# Altium schematic sheet Debug.SchDoc
size A
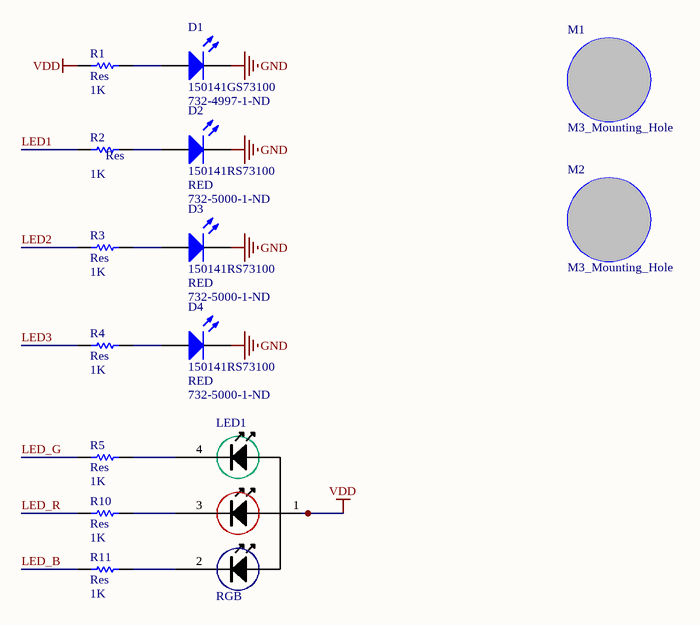
[diagram p0: Debug.SchDoc]

## Parts
D1  150141GS73100  Supplier Part Number 1: 732-4997-1-ND  [150141RS73100]
D2  150141RS73100  Colour: RED  Supplier Part Number 2: 732-5000-1-ND  [150141RS73100]
D3  150141RS73100  Colour: RED  Supplier Part Number 2: 732-5000-1-ND  [150141RS73100]
D4  150141RS73100  Colour: RED  Supplier Part Number 2: 732-5000-1-ND  [150141RS73100]
LED1  RGB  [1411LED]
M1  M3_Mounting_Hole  [M3_Mounting_Hole]
M2  M3_Mounting_Hole  [M3_Mounting_Hole]
R1  Res  value 1K  [3216[1206]]
R2  Res  value 1K  [3216[1206]]
R3  Res  value 1K  [3216[1206]]
R4  Res  value 1K  [3216[1206]]
R5  Res  value 1K  [3216[1206]]
R10  Res  value 1K  [3216[1206]]
R11  Res  value 1K  [3216[1206]]

## Nets
GND: D1.2(K) D2.2(K) D3.2(K) D4.2(K)
VDD: LED1.1 R1.1
LED1: R2.1
LED2: R3.1
LED3: R4.1
LED_B: R11.1
LED_G: R5.1
LED_R: R10.1
NetD1_1: D1.1(A) R1.2
NetD2_1: D2.1(A) R2.2
NetD3_1: D3.1(A) R3.2
NetD4_1: D4.1(A) R4.2
NetLED1_2: LED1.2 R11.2
NetLED1_3: LED1.3 R10.2
NetLED1_4: LED1.4 R5.2

## Library data of the parts
D1 = 150141GS73100: Typical GREEN LED; Manufacturer: Würth Elektronik (Wuerth Elektronik); Luminous Intensity: 1000; Viewing Angle: 120; Forward Voltage: 3.1; Lens Style: Round,Clear; Wavelength: 525; Forward Current: 30; Test Current: 20; Supplier 1: Digikey; Manufacturer Part Number: 150141GS73100; Stock 1: 572; Pricing 1: 1=0.17, 100=0.149, 500=0.113 (USD); Case/Package: 1411; Colour: Green; Case Code (Metric): 3528; Case Code (Imperial): 1411; Min Operating Temperature: -40; Max Operating Temperature: 85; Packaging: Cut Tape; Package Quantity: 2000; Dominant Wavelength: 525; Length: 3.5; Height: 1.9; Width: 2.8; REACH SVHC: Unknown; Lead Free: Lead Free; ComponentLink1URL: https://datasheet.ciiva.com/23843/150141gs73100-23843266.pdf; ComponentLink1Description: https://datasheet.ciiva.com/23843/150141gs73100-23843266.pdf; ComponentLink2URL: https://datasheet.ciiva.com/22656/1911484-22656997.pdf; ComponentLink2Description: https://datasheet.ciiva.com/22656/1911484-22656997.pdf; ComponentLink3URL: https://datasheet.ciiva.com/29563/150141gs73100-29563029.pdf; ComponentLink3Description: https://datasheet.ciiva.com/29563/150141gs73100-29563029.pdf; ComponentLink4URL: https://datasheet.ciiva.com/29563/150141gs73100-29563030.pdf; ComponentLink4Description: https://datasheet.ciiva.com/29563/150141gs73100-29563030.pdf; ComponentLink5URL: https://datasheet.ciiva.com/48430/150141gs73100-eng-tds-48430060.pdf; ComponentLink5Description: https://datasheet.ciiva.com/48430/150141gs73100-eng-tds-48430060.pdf; ComponentLink6URL: https://datasheet.ciiva.com/29278/759463-da-01-en-smd-topled-einf-gruen-150141gs73100-29278953.pdf; ComponentLink6Description: https://datasheet.ciiva.com/29278/759463-da-01-en-smd-topled-einf-gruen-150141gs73100-29278953.pdf
D2-D4 = 150141RS73100: Typical RED LED; Manufacturer: Würth Elektronik (Wuerth Elektronik); Luminous Intensity: 300; Viewing Angle: 120; Forward Voltage: 2; Lens Style: Round,Clear; Wavelength: 625; Forward Current: 30; Test Current: 20; Published: 8-Jun-2000; LatestRevisionDate: 17-Jul-2002; LatestRevisionNote: Re-released for DXP Platform.; PackageDocument: Feb-2002; PackageReference: 3.2X1.6X1.1; Publisher: Altium Limited; Supplier 1: Digi-Key; Supplier 2: Digikey; Manufacturer Part Number: 150141RS73100; Stock 2: 5335; Pricing 2: 1=0.17, 100=0.149, 500=0.113 (USD); Case/Package: 1411; Case Code (Metric): 3528; Case Code (Imperial): 1411; Min Operating Temperature: -40; Max Operating Temperature: 85; Package Quantity: 2000; Packaging: Tape and Reel; Dominant Wavelength: 625; Length: 3.5; Height: 1.9; Width: 2.8; REACH SVHC: Unknown; ComponentLink1URL: https://datasheet.ciiva.com/29562/150141rs73100-29562993.pdf; ComponentLink1Description: https://datasheet.ciiva.com/29562/150141rs73100-29562993.pdf; ComponentLink2URL: https://datasheet.ciiva.com/29563/150141rs73100-29563031.pdf; ComponentLink2Description: https://datasheet.ciiva.com/29563/150141rs73100-29563031.pdf; ComponentLink3URL: https://datasheet.ciiva.com/29563/150141rs73100-29563032.pdf; ComponentLink3Description: https://datasheet.ciiva.com/29563/150141rs73100-29563032.pdf; ComponentLink4URL: https://datasheet.ciiva.com/29278/759464-da-01-en-smd-topled-einf-rot-150141rs73100-29278947.pdf; ComponentLink4Description: https://datasheet.ciiva.com/29278/759464-da-01-en-smd-topled-einf-rot-150141rs73100-29278947.pdf
LED1 = LED_150141M173100: Wurth RGB LED 1411 pkg; Manufacturer: Wurth Electronics Inc; Color: Red, Green, Blue (RGB); Lens Color: Colorless; Lens Transparency: Clear; Millicandela Rating: 270mcd Red, 950mcd Green, 230mcd Blue; Lens Style/Size: Round with Flat Top, 2.40mm; Voltage - Forward (Vf) (Typ): 2V Red, 3.2V Green, 3.2V Blue; Current - Test: 20mA Red, 20mA Green, 20mA Blue; Viewing Angle: 120°; Wavelength - Dominant: 625nm Red, 520nm Green, 470nm Blue; Wavelength - Peak: 635nm Red, 515nm Green, 465nm Blue; Supplier 1: Digi-Key; Supplier Part Number 1: 732-4998-1-ND; RoHS: RoHS Compliant; Category: Optoelectronics; Stock 1: 986; Pricing 1: 1=0.95, 50=0.8294, 100=0.7583, 500=0.68724, 1000=0.63984 (CAD); Packaging: Cut Tape (CT); Mounting Type: Surface Mount; Features: -; Package / Case: 1411 (3528 Metric); Supplier Device Package: 3528; Size / Dimension: 3.50mm L x 2.80mm W; Height (Max): 2.10mm; ComponentLink1URL: http://katalog.we-online.de/led/datasheet/150141M173100.pdf; ComponentLink1Description: http://katalog.we-online.de/led/datasheet/150141M173100.pdf; Manufacturer Part Number: 150141M173100
R1-R5 R10 R11 = Res: Surface Mount Resistor; Published: 8-Jun-2000; LatestRevisionDate: 17-Jul-2002; LatestRevisionNote: Re-released for DXP Platform.; PackageReference: AXIAL-0.5; Publisher: Altium Limited